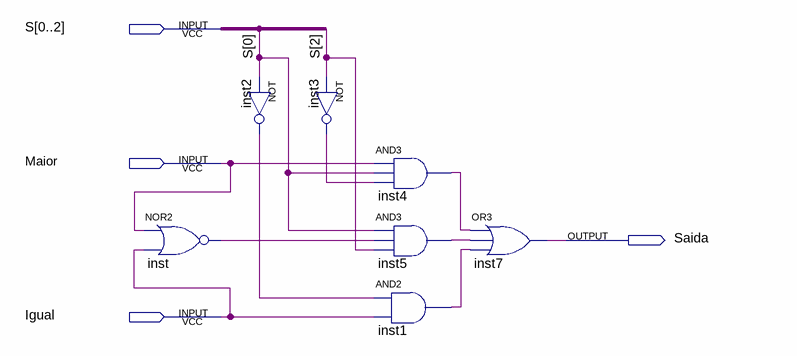
[diagram p0: schematic sheet]
// Quartus schematic multiBool.bdf as structural Verilog: 7 symbols, 4 pins
module multiBool (
  input  [0:2] S,
  input  Maior,
  input  Igual,
  output Saida
);

  wire inst1_out, inst2_out, inst3_out, inst4_out, inst5_out, inst_out;

  nor inst (inst_out, Maior, Igual);
  not inst2 (inst2_out, S[0]);
  not inst3 (inst3_out, S[2]);
  and inst4 (inst4_out, Maior, S[0], inst3_out);
  and inst5 (inst5_out, S[0], inst_out, S[2]);
  and inst1 (inst1_out, inst2_out, Igual);
  or inst7 (Saida, inst4_out, inst5_out, inst1_out);
endmodule
